# Altium schematic sheet 3_ZynTra-Zynq-Config.SchDoc
size 508 x 330 mm; SheetNumber: 3; SheetTotal: 10
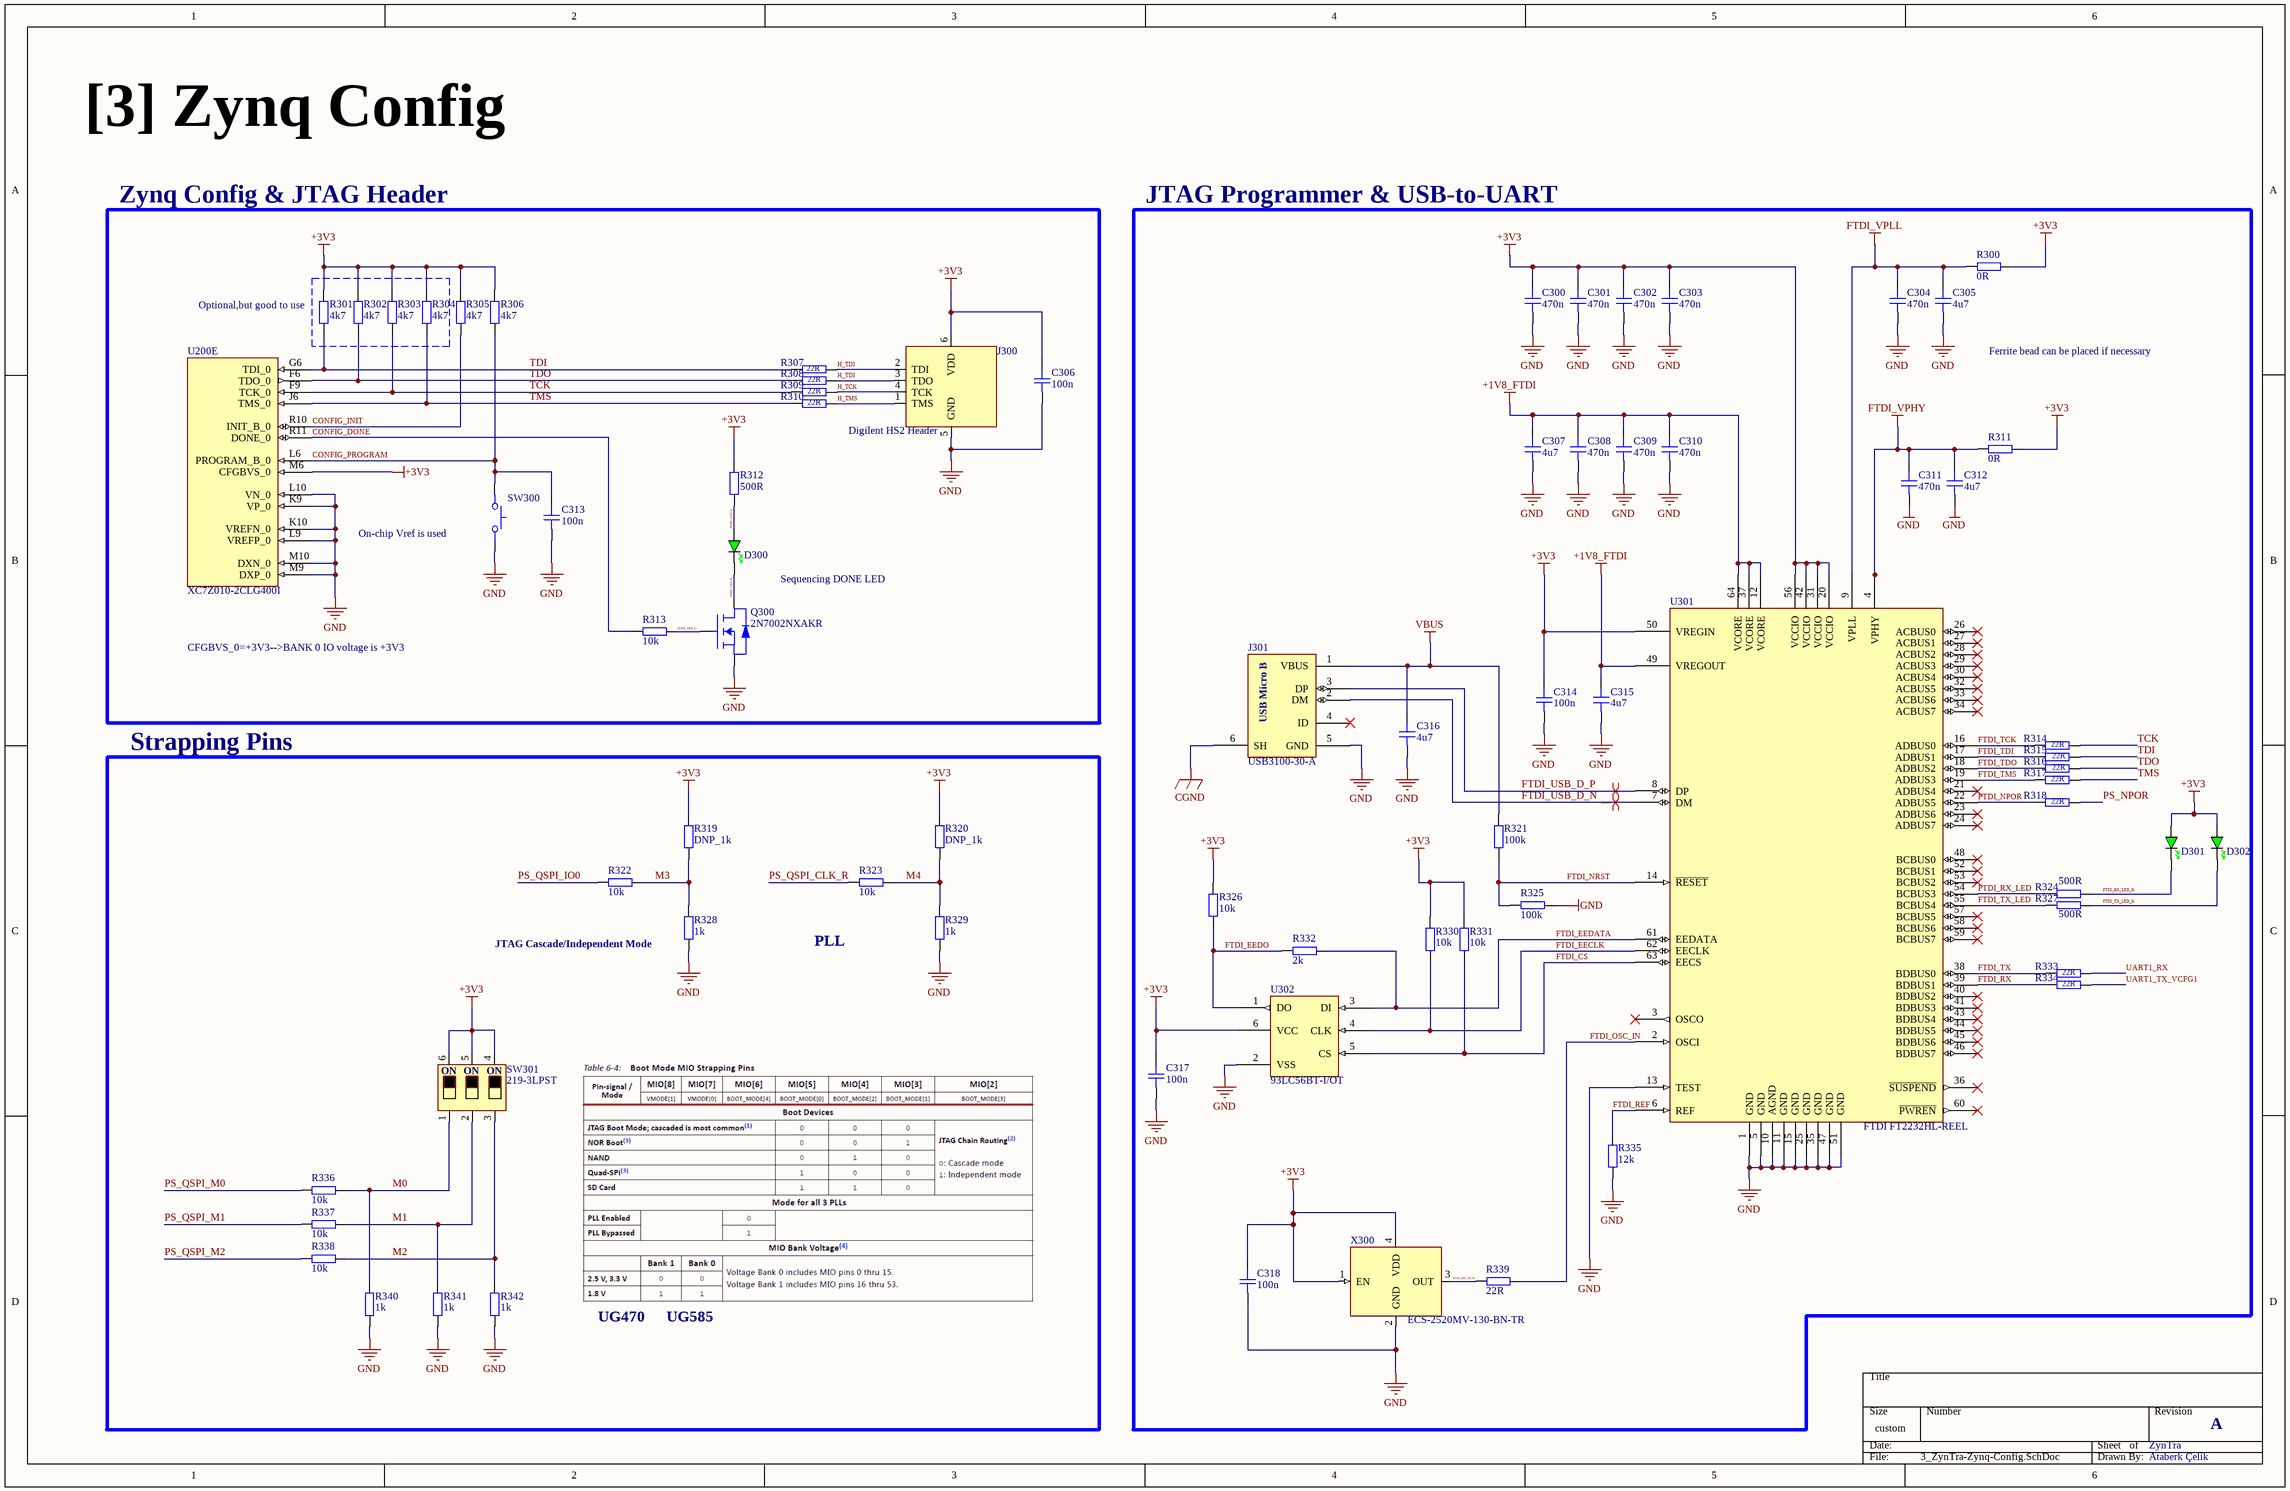
[diagram p0: 3_ZynTra-Zynq-Config.SchDoc]

## Parts
C300  470n  [CAP_0201]
C301  470n  [CAP_0201]
C302  470n  [CAP_0201]
C303  470n  [CAP_0201]
C304  470n  [CAP_0201]
C305  4u7  [CAP_0402]
C306  100n  [CAP_0201]
C307  4u7  [CAP_0402]
C308  470n  [CAP_0201]
C309  470n  [CAP_0201]
C310  470n  [CAP_0201]
C311  470n  [CAP_0201]
C312  4u7  [CAP_0402]
C313  100n  [CAP_0201]
C314  100n  [CAP_0201]
C315  4u7  [CAP_0402]
C316  4u7  [CAP_0402]
C317  100n  [CAP_0201]
C318  100n  [CAP_0201]
D300  GREEN  [LED_0603_GREEN]  (value not drawn)
D301  GREEN  [LED_0603_GREEN]  (value not drawn)
D302  GREEN  [LED_0603_GREEN]  (value not drawn)
J300  Digilent HS2 Header  [DIGILENT_HS2]
J301  USB3100-30-A  [USB3100-30-A]
Q300  2N7002NXAKR  [SSM3J338R,LF-SOT23-F]
R300  0R  [RES_0402]
R301  4k7  [RES_0201]
R302  4k7  [RES_0201]
R303  4k7  [RES_0201]
R304  4k7  [RES_0201]
R305  4k7  [RES_0201]
R306  4k7  [RES_0201]
R307  22R  [RES_0402]
R308  22R  [RES_0402]
R309  22R  [RES_0402]
R310  22R  [RES_0402]
R311  0R  [RES_0402]
R312  500R  [RES_0402]
R313  10k  [RES_0402]
R314  22R  [RES_0402]
R315  22R  [RES_0402]
R316  22R  [RES_0402]
R317  22R  [RES_0402]
R318  22R  [RES_0402]
R319  DNP_1k  [RES_0402]
R320  DNP_1k  [RES_0402]
R321  100k  [RES_0402]
R322  10k  [RES_0402]
R323  10k  [RES_0402]
R324  500R  [RES_0402]
R325  100k  [RES_0402]
R326  10k  [RES_0402]
R327  500R  [RES_0402]
R328  1k  [RES_0402]
R329  1k  [RES_0402]
R330  10k  [RES_0402]
R331  10k  [RES_0402]
R332  2k  [RES_0402]
R333  22R  [RES_0402]
R334  22R  [RES_0402]
R335  12k  [RES_0402]
R336  10k  [RES_0402]
R337  10k  [RES_0402]
R338  10k  [RES_0402]
R339  22R  [RES_0402]
R340  1k  [RES_0402]
R341  1k  [RES_0402]
R342  1k  [RES_0402]
SW300  SKRPANE010  [SKRPANE010]  (value not drawn)
SW301  219-3LPST  [219-3LPST]
U200  XC7Z010-2CLG400I  [CLG400, 0.8mm, 17x17]  (part E of 9)
U301  FTDI FT2232HL-REEL  [LQFP, 64, 12x12mm]
U302  93LC56BT-I/OT  [SOT23-6, 1.60x2.90]
X300  ECS-2520MV-130-BN-TR  [XTAL_2520]

## Blocks framed on the sheet
Zynq Config & JTAG Header: C306 C313 D300 J300 Q300 R301-R310 R312 R313 SW300 U200
JTAG Programmer & USB-to-UART: C300-C305 C307-C312 C314-C318 D301 D302 J301 R300 R311 R314-R318 R321 R324-R327 R330-R335 R339 U301 U302 X300
Strapping Pins: R319 R320 R322 R323 R328 R329 R336-R338 R340-R342 SW301

## Nets
+1V8_FTDI: C307.2 C308.2 C309.2 C310.2 C315.2 U301.12(VCORE) U301.37(VCORE) U301.49(VREGOUT) U301.64(VCORE)
+3V3: C300.2 C301.2 C302.2 C303.2 C306.2 C314.2 C317.2 C318.2 D301.A D302.A J300.6(VDD) R300.2 R301.2 R302.2 R303.2 R304.2 R305.2 R306.2 R311.2 R312.1 R319.2 R320.2 R326.2 R330.2 R331.2 SW301.4 SW301.5 SW301.6 U200.M6(CFGBVS_0) U301.20(VCCIO) U301.31(VCCIO) U301.42(VCCIO) U301.50(VREGIN) U301.56(VCCIO) U302.6(VCC) X300.1(EN) X300.4(VDD)
CGND: J301.6(SH)
FTDI_VPHY: C311.2 C312.2 R311.1 U301.4(VPHY)
FTDI_VPLL: C304.2 C305.2 R300.1 U301.9(VPLL)
GND: C300.1 C301.1 C302.1 C303.1 C304.1 C305.1 C306.1 C307.1 C308.1 C309.1 C310.1 C311.1 C312.1 C313.1 C314.1 C315.1 C316.1 C317.1 C318.1 J300.5(GND) J301.5(GND) Q300.S R325.1 R328.1 R329.1 R335.1 R340.1 R341.1 R342.1 SW300.34 U200.K9(VP_0) U200.K10(VREFN_0) U200.L9(VREFP_0) U200.L10(VN_0) U200.M9(DXP_0) U200.M10(DXN_0) U301.1(GND) U301.5(GND) U301.10(AGND) U301.11(GND) U301.13(TEST) U301.15(GND) U301.25(GND) U301.35(GND) U301.47(GND) U301.51(GND) U302.2(VSS) X300.2(GND)
VBUS: C316.2 J301.1(VBUS) R321.2
CONFIG_DONE: R313.1 U200.R11(DONE_0)
CONFIG_INIT: R305.1 U200.R10(INIT_B_0)
CONFIG_PROGRAM: C313.2 R306.1 SW300.12 U200.L6(PROGRAM_B_0)
DONE_LED_A: D300.A R312.2
DONE_LED_K: D300.K Q300.D
DONE_MOS_G: Q300.G R313.2
FTDI_CS: R331.1 U301.63(EECS) U302.5(CS)
FTDI_EECLK: R330.1 U301.62(EECLK) U302.4(CLK)
FTDI_EEDATA: R332.1 U301.61(EEDATA) U302.3(DI)
FTDI_EEDO: R326.1 R332.2 U302.1(DO)
FTDI_NPOR: R318.2 U301.22(ADBUS5)
FTDI_NRST: R321.1 R325.2 U301.14(~{RESET})
FTDI_OSC_IN: R339.1 U301.2(OSCI)
FTDI_OSC_IN_R: R339.2 X300.3(OUT)
FTDI_REF: R335.2 U301.6(REF)
FTDI_RX: R334.2 U301.39(BDBUS1)
FTDI_RX_LED: R324.2 U301.54(BCBUS3)
FTDI_RX_LED_K: D301.K R324.1
FTDI_TCK: R314.2 U301.16(ADBUS0)
FTDI_TDI: R315.2 U301.17(ADBUS1)
FTDI_TDO: R316.2 U301.18(ADBUS2)
FTDI_TMS: R317.2 U301.19(ADBUS3)
FTDI_TX: R333.2 U301.38(BDBUS0)
FTDI_TX_LED: R327.2 U301.55(BCBUS4)
FTDI_TX_LED_K: D302.K R327.1
FTDI_USB_D_N: J301.2(DM) U301.7(DM)
FTDI_USB_D_P: J301.3(DP) U301.8(DP)
H_TCK: J300.4(TCK) R309.2
H_TDI: J300.2(TDI) J300.3(TDO) R307.2 R308.2
H_TMS: J300.1(TMS) R310.2
M0: R336.2 R340.2 SW301.1
M1: R337.2 R341.2 SW301.2
M2: R338.2 R342.2 SW301.3
M3: R319.1 R322.2 R328.2
M4: R320.1 R323.2 R329.2
PS_NPOR: R318.1
PS_QSPI_CLK_R: R323.1
PS_QSPI_IO0: R322.1
PS_QSPI_M0: R336.1
PS_QSPI_M1: R337.1
PS_QSPI_M2: R338.1
TCK: R303.1 R309.1 R314.1 U200.F9(TCK_0)
TDI: R301.1 R307.1 R315.1 U200.G6(TDI_0)
TDO: R302.1 R308.1 R316.1 U200.F6(TDO_0)
TMS: R304.1 R310.1 R317.1 U200.J6(TMS_0)
UART1_RX: R333.1
UART1_TX_VCFG1: R334.1

Not connected (* = marked no-connect by the designer): J301 4(ID)*; U301 3(OSCO)* 21(ADBUS4)* 23(ADBUS6)* 24(ADBUS7)* 26(ACBUS0)* 27(ACBUS1)* 28(ACBUS2)* 29(ACBUS3)* 30(ACBUS4)* 32(ACBUS5)* 33(ACBUS6)* 34(ACBUS7)* 36(~{SUSPEND})* 40(BDBUS2)* 41(BDBUS3)* 43(BDBUS4)* 44(BDBUS5)* 45(BDBUS6)* 46(BDBUS7)* 48(BCBUS0)* 52(BCBUS1)* 53(BCBUS2)* 57(BCBUS5)* 58(BCBUS6)* 59(BCBUS7)* 60(~{PWREN})*

## Layout directives
differential pair: FTDI_USB_D_N, FTDI_USB_D_P

## Notes on the sheet
- [3] Zynq Config
- (near R301) Optional,but good to use
- Ferrite bead can be placed if necessary
- (near SW300) On-chip Vref is used
- Sequencing DONE LED
- CFGBVS_0=+3V3-->BANK 0 IO voltage is +3V3
- JTAG Cascade/Independent Mode
- PLL
- UG470
- UG585
- ZynTra
- A
- Ataberk Çelik
- (in symbol 219-3LPST) ON
- (in symbol USB3100-30-A) USB Micro B

## Library data of the parts
C300-C304 C306 C308-C311 C313 C314 C317 C318 = CAP_0201: Capacitor SMD 0201; Manufacturer: *; Manufacturer Part Number: *; Distributor Link: *; LCSC: *; Rating: *; Dielectric: *
C305 C307 C312 C315 C316 = CAP_0402: Capacitor SMD 0402; Manufacturer: *; Manufacturer Part Number: *; Distributor Link: *; LCSC: *; Rating: *; Dielectric: *
D300-D302 = LED_0603_GREEN: LED 0603 GREEN SMD
J300 = Digilent_HS2_Header: Digilent HS2 6-Pin 2.54mm Pitch Header; Manufacturer: Amphenol FCI; Manufacturer Part Number: 68000-406HLF
J301 = USB3100-30-A: Micro USB Receptacle, Type B, Surface Mount, Horizontal
Q300 = 2N7002NXAKR: MOSFET N-Channel Vds=60V Id=300mA with ESD Protection; Manufacturer: Nexperia; Manufacturer Part Number: 2N7002NXAKR
R300 R307-R342 = RES_0402: Resistor SMD 0402; Manufacturer: *; Manufacturer Part Number: *; Distributor Link: *; LCSC: *
R301-R306 = RES_0201: Resistor SMD 0201; Manufacturer: *; Manufacturer Part Number: *; Distributor Link: *; LCSC: *
SW300 = SKRPANE010: Tactile Switch SMD SPST; Manufacturer: Alps Alpine; Manufacturer Part Number: SKRPANE010
SW301 = 219-3LPST: DIP Switches SPST 3x; Manufacturer: CTS; Manufacturer Part Number: 219-3LPST
U200 = XC7Z010-2CLG400I: Zynq 7000S SoC devices feature a single-core Arm® Cortex®-A9 processor mated with 28 nm AMD Artix™ 7 based programmable logic, representing a low cost entry point to the scalable Zynq 7000 platform. Available with 6.25 Gb/s transceivers and outfitted with commonly used hardened peripherals, the Zynq 7000S delivers cost-optimized system integration ideal for industrial IoT applications such as motor control and embedded vision.; Manufacturer: AMD / Xilinx; Manufacturer Part Number: XC7Z010-2CLG400I; Supplier Link: https://www.mouser.com.tr/ProductDetail/AMD-Xilinx/XC7Z010-2CLG400I?qs=rrS6PyfT74cETvLeyRFHTA%3D%3D
U302 = 93LC56BT-I/OT: 2-Kbit Microwire Compatible Serial EEPROM; Manufacturer: Microchip; Manufacturer Part Number: 93LC56BT-I/OT; Supplier Link: https://www.mouser.com.tr/ProductDetail/Microchip-Technology/93LC56BT-I-OT?qs=lQv0JY93vrc7B5Rh5LPW8g%3D%3D&srsltid=AfmBOoog9BmJ_7H7C7v997_1yIIFw87wkM-Azk-UmBmq9KE1ZdzKQL_v
X300 = ECS-2520MV-130-BN-TR: Standard Clock Oscillators XO (Standard),13MHz,Standby (Power Down),CMOS, Multi-Volt,1.6 V 3.6 V,+/-50ppm,-40 C 85 C,6mA,Surface Mount,4-SMD, No Lead,(2.50mm x 2.00mm),(0.80mm); Manufacturer: ECS; Manufacturer Part Number: ECS-2520MV-130-BN-TR
U301 = FTDI FT2232HL-REEL: Manufacturer: FTDI; Manufacturer Part Number: FT2232HL-REEL; Supplier Link: https://www.lcsc.com/product-detail/C27882.html